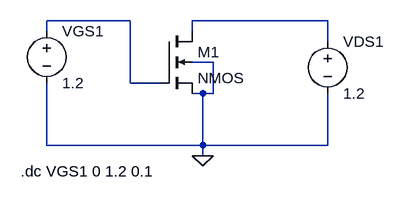
[diagram p0: schematic nmos_90.asc]
nmos_90.asc, the LTspice schematic file:
Version 4.1
SHEET 1 880 680
WIRE 192 96 64 96
WIRE 496 96 288 96
WIRE 64 112 64 96
WIRE 288 112 288 96
WIRE 496 128 496 96
WIRE 320 160 288 160
WIRE 192 192 192 96
WIRE 240 192 192 192
WIRE 304 208 288 208
WIRE 320 208 320 160
WIRE 320 208 304 208
WIRE 64 288 64 192
WIRE 304 288 304 208
WIRE 304 288 64 288
WIRE 496 288 496 208
WIRE 496 288 304 288
WIRE 304 304 304 288
FLAG 304 304 0
SYMBOL nmos4 240 112 R0
SYMATTR InstName M1
SYMATTR Value2 l=90n w=135n
SYMBOL voltage 64 96 R0
SYMATTR InstName VGS1
SYMATTR Value 1.2
SYMBOL voltage 496 112 R0
SYMATTR InstName VDS1
SYMATTR Value 1.2
TEXT 24 328 Left 2 !.dc VGS1 0 1.2 0.1

The netlist it stands for:
* nmos_90.asc
M1 N002 N001 0 0 NMOS l=90n w=135n
VGS1 N001 0 1.2
VDS1 N002 0 1.2
.model NMOS NMOS
.model PMOS PMOS
.lib standard.mos
.dc VGS1 0 1.2 0.1
.backanno
.end